# Altium schematic sheet 大号发球机.SchDoc
size A3
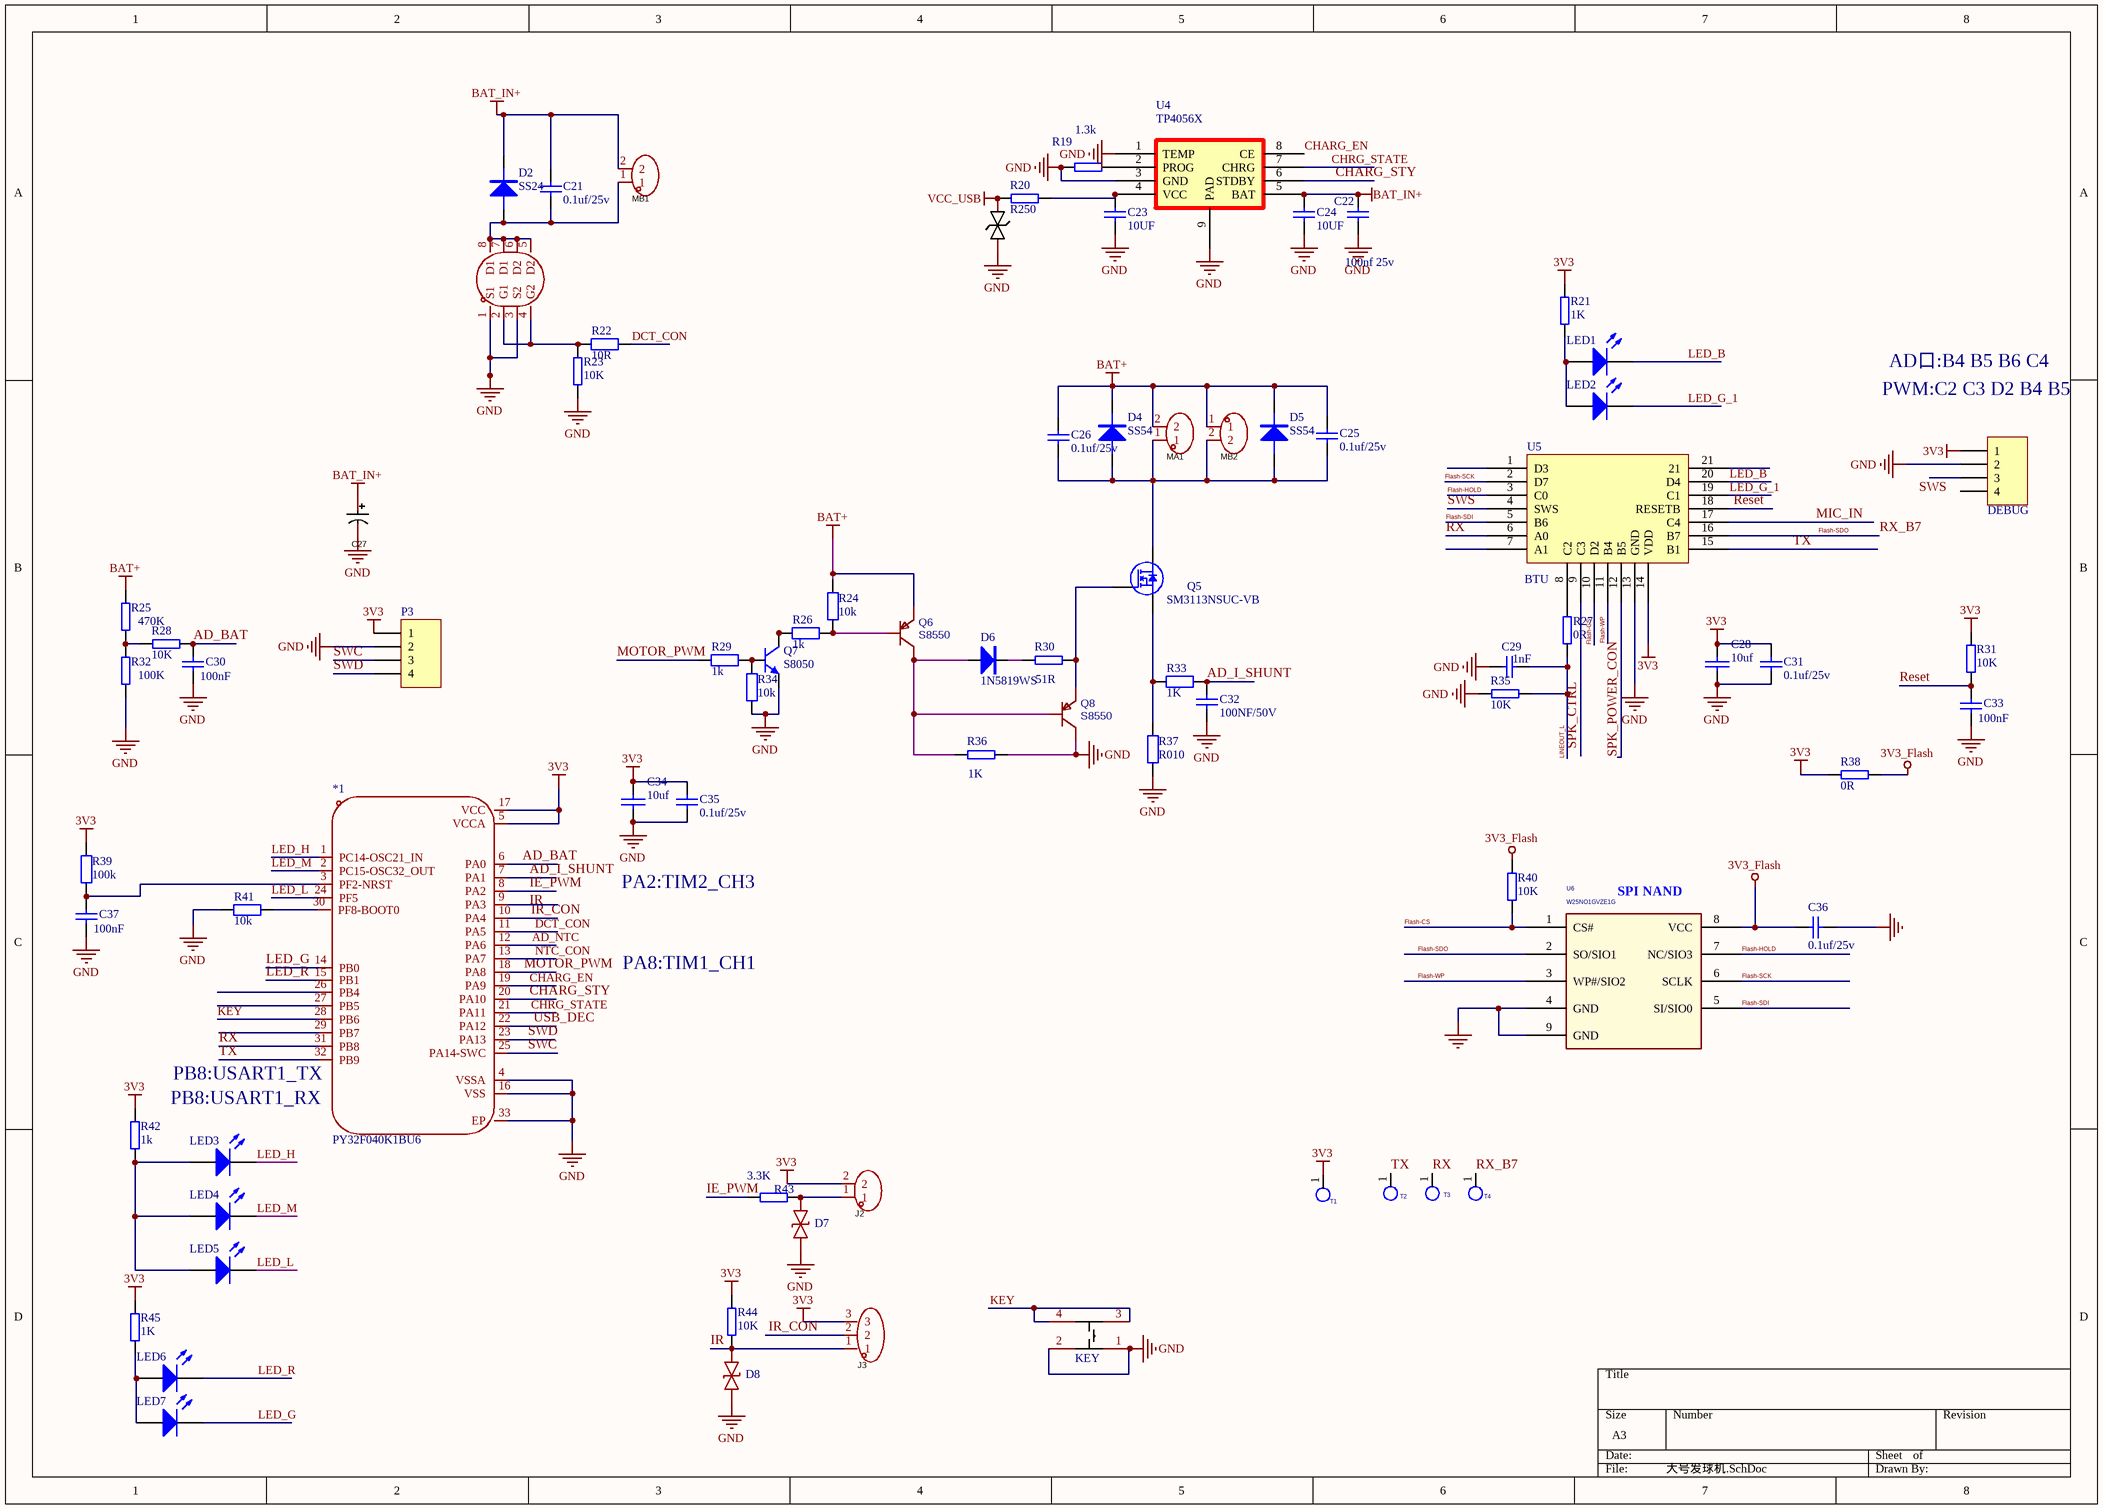
[diagram p0: 大号发球机.SchDoc]

## Parts
*1  PY32F040K1BU6  [QFN-32_L5.0-W5.0-P0.50-BL-EP3.4]
C21  0.1uf/25v  [0805_C]
C22  100nf 25v  [0603_C]
C23  10UF  [0603_c]
C24  10UF  [0603_c]
C25  0.1uf/25v  [0805_C]
C26  0.1uf/25v  [0805_C]
C27  220uf/25v  [SMD 6.3*7.7]  (value not drawn)
C28  10uf  [0603_c]
C29  1nF  [0603_C]
C30  100nF  [0603_C]
C31  0.1uf/25v  [0603_C]
C32  100NF/50V  [0603_C]
C33  100nF  [0603_C]
C34  10uf  [0603_c]
C35  0.1uf/25v  [0603_C]
C36  0.1uf/25v  [0603_C]
C37  100nF  [0603_C]
D2  SS24  [SMA]
D3  SMF5.0CA_C726939  [SOD-123 双向]  (value not drawn)
D4  SS54  [SMA]
D5  SS54  [SMA]
D6  1N5819WS  [SOD-323]
D7  LESD5Z5.0CT1G  [SOD-523_L1.2-W0.8-LS1.6-RD]  (value not drawn)
D8  LESD5Z5.0CT1G  [SOD-523_L1.2-W0.8-LS1.6-RD]  (value not drawn)
J2  BX-PH2.0-2PZZ  [CONN-TH_2P-P2.50_ZX-XH2.54-2PWZ]  (value not drawn)
J3  BX-PH2.0-3PZZ  [HDR-TH_3P-P2.50_ZX-XH2.54-3PWZ]  (value not drawn)
K1  KEY  [KEY_SMD_4P]
LED1  (no value)  [0805_LED]
LED2  (no value)  [0805_LED]
LED3  (no value)  [0805_LED]
LED4  (no value)  [0805_LED]
LED5  (no value)  [0805_LED]
LED6  (no value)  [0805_LED]
LED7  (no value)  [0805_LED]
MA1  BX-PH2.0-2PZZ  [CONN-TH_2P-P2.50_ZX-XH2.54-2PWZ]  (value not drawn)
MB1  BX-PH2.0-2PZZ  [CONN-TH_2P-P2.50_ZX-XH2.54-2PWZ]  (value not drawn)
MB2  BX-PH2.0-2PZZ  [CONN-TH_2P-P2.50_ZX-XH2.54-2PWZ]  (value not drawn)
P2  DEBUG  [SIP4-2.54]
P3  (no value)  [4P 2.0]
Q4  WSP9936  [SOP8-9]  (value not drawn)
Q5  SM3113NSUC-VB  [TO-252]
Q6  S8550  [SOT-23]
Q7  S8050  [SOT-23(SOT-23-3)]
Q8  S8550  [SOT-23]
R19  1.3k  [0603_R]
R20  R250  [1206_R]
R21  1K  [0603_R]
R22  10R  [0603_R]
R23  10K  [0603_R]
R24  10k  [0603_R]
R25  470K  [0603_R]
R26  1k  [0603_R]
R27  0R  [0603_R]
R28  10K  [0603_R]
R29  1k  [0603_R]
R30  51R  [0603_R]
R31  10K  [0603_R]
R32  100K  [0603_R]
R33  1K  [0603_R]
R34  10k  [0603_R]
R35  10K  [0603_R]
R36  1K  [0603_R]
R37  R010  [2512_R]
R38  0R  [0603_R]
R39  100k  [0603_R]
R40  10K  [0603_R]
R41  10k  [0603_R]
R42  1k  [0603_r]
R43  3.3K  [0603_R]
R44  10K  [0603_R]
R45  1K  [0603_R]
T1  T_POINT  [MAK]  (value not drawn)
T2  T_POINT  [MAK]  (value not drawn)
T3  T_POINT  [MAK]  (value not drawn)
T4  T_POINT  [MAK]  (value not drawn)
U4  TP4056X  [SOP8-9]
U5  BTU  [BTU]
U6  W25NO1GVZE1G  [SOP8-150+208]

## Nets
3V3: *1.5(VCCA) *1.17(VCC) C28.2 C31.1 C34.2 C35.1 J2.2 J3.3 P2.1 P3.1 R21.1 R31.1 R38.1 R39.1 R42.1 R44.2 R45.1 T1.1(TP) U5.14(VDD)
3V3_Flash: C36.1 R38.2 R40.2 U6.8(VCC)
BAT+: C25.2 C26.2 D4.2(K) D5.2(K) MA1.2 MB2.1 Q6.2(E) R24.2 R25.1
BAT_IN+: C21.2 C22.1 C24.2 C27.1 D2.2(K) MB1.2 U4.5(BAT)
GND: *1.4(VSSA) *1.16(VSS) *1.33(EP) C22.2 C23.1 C24.1 C27.2 C28.1 C29.2 C30.1 C31.2 C32.2 C33.1 C34.1 C35.2 C36.2 C37.1 D3.1 D7.1 D8.1 K1.1 K1.2 P2.2 P3.2 Q4.1(S1) Q4.3(S2) Q7.2(E) Q8.3(C) R19.1 R23.1 R32.2 R34.1 R35.1 R36.1 R37.1 R41.2 U4.1(TEMP) U4.3(GND) U4.9(PAD) U5.13(GND) U6.4(GND) U6.9(GND)
VCC_USB: D3.2 R20.2
AD_BAT: *1.6(PA0) C30.2 R28.2
AD_I_SHUNT: *1.7(PA1) C32.1 R33.1
AD_NTC: *1.12(PA6)
CHARG_EN: *1.19(PA9) U4.8(CE)
CHARG_STY: *1.20(PA10) U4.6(STDBY)
CHRG_STATE: *1.21(PA11) U4.7(CHRG)
DCT_CON: *1.11(PA5) R22.1
Flash-CS: R40.1 U5.10(D2) U6.1(CS#)
Flash-HOLD: U5.3(C0) U6.7(NC/SIO3)
Flash-SCK: U5.2(D7) U6.6(SCLK)
Flash-SDI: U5.5(B6) U6.5(SI/SIO0)
Flash-SDO: T4.1(TP) U5.16(B7) U6.2(SO/SIO1)  [also labelled RX_B7]
Flash-WP: U5.11(B4) U6.3(WP#/SIO2)
IE_PWM: *1.8(PA2) R43.1
IR: D8.2 J3.1 R44.1
IR_CON: *1.10(PA4) J3.2
KEY: *1.28(PB6) K1.3 K1.4
LED_B: LED1.2(K) U5.20(D4)
LED_G: *1.14(PB0) LED7.2(K)
LED_G_1: LED2.2(K) U5.19(C1)
LED_H: *1.1(PC14-OSC21_IN) LED3.2(K)
LED_L: *1.24(PF5) LED5.2(K)
LED_M: *1.2(PC15-OSC32_OUT) LED4.2(K)
LED_R: *1.15(PB1) LED6.2(K)
LINEOUT_L: C29.1 R27.1 R35.2
MIC_IN: U5.17(C4)
MOTOR_PWM: *1.18(PA8) R29.1
NTC_CON: *1.13(PA7)
Reset: C33.2 R31.2 U5.18(RESETB)
RX: *1.31(PB8) T3.1(TP) U5.6(A0)
SPK_CTRL: U5.9(C3)
SPK_POWER_CON: U5.12(B5)
SWC: *1.25(PA14-SWC) P3.3
SWD: *1.23(PA13) P3.4
SWS: P2.3 U5.4(SWS)
TX: *1.32(PB9) T2.1(TP) U5.15(B1)
USB_DEC: *1.22(PA12)
Net*1_3: *1.3(PF2-NRST) C37.2 R39.2
Net*1_30: *1.30(PF8-BOOT0) R41.1
NetC21_1: C21.1 D2.1(A) MB1.1 Q4.5(D2) Q4.6(D2) Q4.7(D1) Q4.8(D1)
NetC23_2: C23.2 R20.1 U4.4(VCC)
NetC25_1: C25.1 C26.1 D4.1(A) D5.1(A) MA1.1 MB2.2 Q5.2(D)
NetD6_1: D6.1(A) Q6.3(C) Q8.1(B) R36.2
NetD6_2: D6.2(K) R30.2
NetD7_2: D7.2 J2.1 R43.2
NetLED1_1: LED1.1(A) LED2.1(A) R21.2
NetLED3_1: LED3.1(A) LED4.1(A) LED5.1(A) R42.2
NetLED6_1: LED6.1(A) LED7.1(A) R45.2
NetQ4_2: Q4.2(G1) Q4.4(G2) R22.2 R23.2
NetQ5_1: Q5.1(G) Q8.2(E) R30.1
NetQ5_3: Q5.3(S) R33.2 R37.2
NetQ6_1: Q6.1(B) R24.1 R26.2
NetQ7_1: Q7.1(B) R29.2 R34.2
NetQ7_3: Q7.3(C) R26.1
NetR19_2: R19.2 U4.2(PROG)
NetR25_2: R25.2 R28.1 R32.1
NetR27_2: R27.2 U5.8(C2)

Not connected (* = marked no-connect by the designer): *1 9(PA3) 26(PB4) 27(PB5) 29(PB7); P2 4; U5 1(D3) 7(A1) 21

## Notes on the sheet
- AD口:B4 B5 B6 C4
- (near P2) PWM:C2 C3 D2 B4 B5
- PA2:TIM2_CH3
- (near U6) SPI NAND
- PA8:TIM1_CH1
- PB8:USART1_RX
- (near *1) PB8:USART1_TX
- Labels drawn without touching a wire or pin: IR

## Library data of the parts
C21 C22 C25 C26 C31 C35 C36 = Cap: Capacitor; Value: 10nF; Published: 8-Jun-2000; Revision: July-2002: Re-released for DXP Platform.; Publisher: Altium Limited
C23 C24 C29 C30 C33 C37 = CAP
C27 = RVT1A221M0605_C72494: Symbol: RVT1A221M0605-C72494; Value: 220uF; Add into BOM: yes; Rated Voltage: 10V; Ripple Current: 90mA@120Hz; L: 5.4mm; Device: RVT1A221M0605_C72494; Supplier: LCSC; Manufacturer Part: RVT1A221M0605; Supplier Part: C72494; JLCPCB Part Class: Extended Part; Supplier Footprint: SMD,D6.3xL5.4mm; Datasheet: https://atta.szlcsc.com/upload/public/pdf/source/20170325/1490427950282.pdf; Convert to PCB: yes; Equivalent Series Resistance(ESR): -
C28 C34 = C-0603: C-?-K-0603; CompNAME: 贴片电容; $MaterialClass: Component; $MaterialID: 12063014; CompCLASSIFICATION: ;电子元器件; Comp_Spec: C-104-50V-X7R-M-0603; CompID: 12063014
C32 = Cap1: 无极电容
D2 D4 D5 = D-SS24-SMA: DO214AC; CompNAME: 贴片二极管; $MaterialClass: Component; $MaterialID: 12091090; CompCLASSIFICATION: ;电子元器件; Comp_Spec: D-SS24-SMA-40V-2A-0.5V; CompID: 12091090
D3 = SMF5.0CA_C726939: Add into BOM: yes; Symbol: SMF5.0CA_C726939; Device: SMF5.0CA_C726939; Supplier: LCSC; Supplier Part: C726939; Manufacturer Part: SMF5.0CA; JLCPCB Part Class: Extended Part; LCSC Part Name: SMF5.0CA; Supplier Footprint: SOD-123FL; Datasheet: https://atta.szlcsc.com/upload/public/pdf/source/20200825/C726891_B615A55314C94A3B16B7FBCD32D40567.pdf; Convert to PCB: yes
D6 = DIODE
D7 D8 = LESD5Z5.0CT1G: Add into BOM: yes; Reverse Stand-Off Voltage (Vrwm): 5V; Maximum Clamping Voltage: 18.6V; Peak Pulse Current (Ipp)@10/1000us: 9.4A; Breakdown Voltage: 5.6V; Type: ESD; Symbol: LESD5Z5.0CT1G; Device: LESD5Z5.0CT1G; Supplier: LCSC; Manufacturer Part: LESD5Z5.0CT1G; Supplier Part: C136167; Supplier Footprint: SOD-523; Datasheet: https://atta.szlcsc.com/upload/public/pdf/source/20171026/C136167_15089841930291059137.pdf; Convert to PCB: yes
J2 MA1 MB1 MB2 = BX-PH2.0-2PZZ: Add into BOM: yes; Pins Structure: 1x2P; Pitch: 2mm; Reference Series: PH; Number of PINs Per Row: 2; Current Rating (Max): 2A; Symbol: BX-PH2.0-2PZZ; Device: BX-PH2.0-2PZZ; LCSC Part Name: BX-PH2.0-2PZZ; Supplier Part: C18077744; Manufacturer Part: BX-PH2.0-2PZZ; JLCPCB Part Class: Extended Part; Datasheet: https://atta.szlcsc.com/upload/public/pdf/source/20231017/0F5D8A357D6F7BFB4F7225D5BDBA6EB1.pdf; Supplier: LCSC; Convert to PCB: yes; Number of Pins: 2P; Number of Rows: 1; Row Spacing: -; Comment_1: BX-PH2.0-2PZZ
J3 = BX-PH2.0-3PZZ: Add into BOM: yes; Pins Structure: 1x3P; Pitch: 2mm; Reference Series: PH; Number of PINs Per Row: 3; Current Rating (Max): 2A; Symbol: BX-PH2.0-3PZZ; Device: BX-PH2.0-3PZZ; LCSC Part Name: BX-PH2.0-3PZZ; Supplier Part: C18077745; Manufacturer Part: BX-PH2.0-3PZZ; JLCPCB Part Class: Extended Part; Datasheet: https://atta.szlcsc.com/upload/public/pdf/source/20231017/78B49E88B01779D5C268ECAB29020769.pdf; Supplier: LCSC; Convert to PCB: yes; Number of Pins: 3P; Number of Rows: 1; Row Spacing: -; Comment_1: BX-PH2.0-3PZZ
K1 = TS-1002S-05026C: Add into BOM: yes; Switch Length: 6mm; Switch Height: 5mm; Contact Current: 50mA; Voltage Rating (DC): 12V; Symbol: TS-1002S-05026C; Device: TS-1002S-05026C; Supplier: LCSC; Supplier Part: C455110; Manufacturer Part: TS-1002S-05026C; JLCPCB Part Class: Extended Part; Supplier Footprint: SMD,6x6mm; Datasheet: https://atta.szlcsc.com/upload/public/pdf/source/20191118/C455126_F61E8FA1ED640FB1CE0B30B55DEB62E3.pdf; Convert to PCB: yes; Switch Width: 6mm; With Lamp: -; Mechanical Life: -
LED1-LED7 = LED0: Typical INFRARED GaAs LED; Published: 8-Jun-2000; LatestRevisionDate: 08-Jul-2005; LatestRevisionNote: Mech Layer 1 removed.; PackageReference: LED-0; Publisher: Altium Limited; PackageDescription: LED; 2 Leads
P2 P3 = Header 4: Header, 4-Pin; LatestRevisionDate: 17-Jul-2002; LatestRevisionNote: Re-released for DXP Platform.; Publisher: Altium Limited
Q4 = WSP9936: Manufacturer: WINSOK(微硕); Add into BOM: yes; Type: 2个N沟道; Drain Source Voltage (Vdss): 20V; Continuous Drain Current (Id): 8A; Drain Source On Resistance (RDS(on)@Vgs,Id): 14mΩ@4.5V,8A; Power Dissipation (Pd): 2W; Gate Threshold Voltage (Vgs(th)@Id): 750mV@250uA; Total Gate Charge (Qg@Vgs): 17nC@4.5V; Input Capacitance (Ciss@Vds): 520pF@10V; Reverse Transfer Capacitance (Crss@Vds): 60pF@10V; Symbol: WSP9936; Device: WSP9936; LCSC Part Name: 双N沟道MOSFET,电流:8A,耐压:20V; Supplier Part: C2758438; Manufacturer Part: WSP9936; Supplier Footprint: SOP-8; JLCPCB Part Class: Extended Part; Datasheet: https://atta.szlcsc.com/upload/public/pdf/source/20210312/C2758438_9AB8EC3FE3457B5FFF0ECD24924D548D.pdf; Supplier: LCSC; Convert to PCB: yes; Operating Temperature: -55℃~+150℃
Q5 = NMOS1: N沟道MOS管
Q6 Q8 = S8550_C545533: BOM_Manufacturer: UMW(Youtai Semiconductor Co., Ltd.); Contributor: LCSC; BOM_Supplier: LCSC; BOM_Supplier Part: C545533; BOM_Manufacturer Part: S8550; BOM_JLCPCB Part Class: Extended Part; spicePre: Q; spiceSymbolName: S8550_C545533
Q7 = NPN_sot23: NPN三极管
R19-R21 R23 R25 R27 R28 R30-R32 R35 R36 R38 R40 R42-R45 = RES
R22 R24 R26 R29 R33 R34 R37 R39 R41 = Res2: Resistor; Value: 120R; Published: 8-Jun-2000; LatestRevisionDate: 17-Jul-2002; LatestRevisionNote: Re-released for DXP Platform.; PackageReference: AXIAL-0.4; Publisher: Altium Limited
T1-T4 = T POINT
U4 = TP4056
U6 = 24C08_3